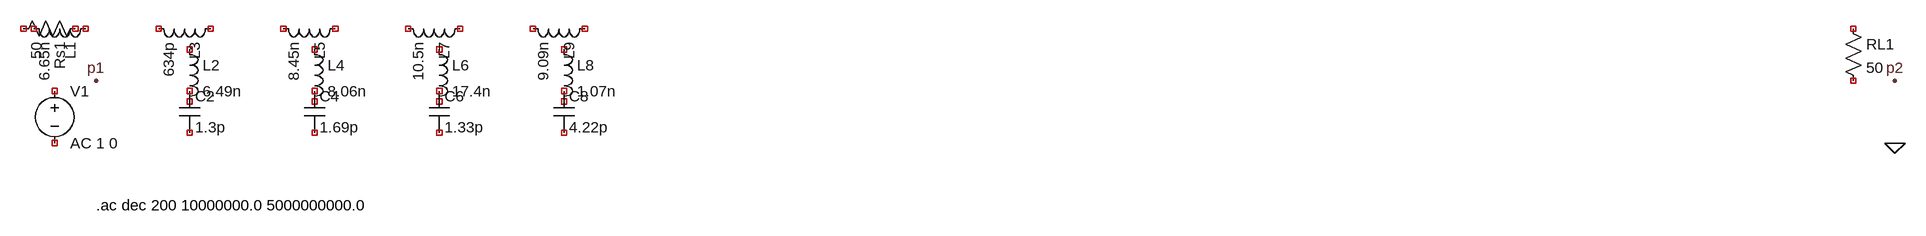
[diagram p0: schematic final.asc]
final.asc, the LTspice schematic file:
Version 4
SHEET 1 1280 720
SYMBOL voltage 32 144 R0
SYMATTR InstName V1
SYMATTR Value AC 1 0
SYMBOL res 80 48 R90
SYMATTR InstName Rs1
SYMATTR Value 50
SYMBOL ind 96 48 R90
SYMATTR InstName L1
SYMATTR Value 6.65n
SYMBOL ind 224 80 R0
SYMATTR InstName L2
SYMATTR Value 6.49n
SYMBOL cap 224 160 R0
SYMATTR InstName C2
SYMATTR Value 1.3p
SYMBOL ind 288 48 R90
SYMATTR InstName L3
SYMATTR Value 634p
SYMBOL ind 416 80 R0
SYMATTR InstName L4
SYMATTR Value 8.06n
SYMBOL cap 416 160 R0
SYMATTR InstName C4
SYMATTR Value 1.69p
SYMBOL ind 480 48 R90
SYMATTR InstName L5
SYMATTR Value 8.45n
SYMBOL ind 608 80 R0
SYMATTR InstName L6
SYMATTR Value 17.4n
SYMBOL cap 608 160 R0
SYMATTR InstName C6
SYMATTR Value 1.33p
SYMBOL ind 672 48 R90
SYMATTR InstName L7
SYMATTR Value 10.5n
SYMBOL ind 800 80 R0
SYMATTR InstName L8
SYMATTR Value 1.07n
SYMBOL cap 800 160 R0
SYMATTR InstName C8
SYMATTR Value 4.22p
SYMBOL ind 864 48 R90
SYMATTR InstName L9
SYMATTR Value 9.09n
SYMBOL res 2784 48 R0
SYMATTR InstName RL1
SYMATTR Value 50
TEXT 96 336 Left 2 !.ac dec 200 10000000.0 5000000000.0
FLAG 96 144 p1
FLAG 2864 144 p2
FLAG 2864 240 0

The netlist it stands for:
* final.asc
V1 NC_01 NC_02 AC 1 0
Rs1 NC_03 NC_04 50
L1 NC_05 NC_06 6.65n
L2 NC_07 NC_08 6.49n
C2 NC_09 NC_10 1.3p
L3 NC_11 NC_12 634p
L4 NC_13 NC_14 8.06n
C4 NC_15 NC_16 1.69p
L5 NC_17 NC_18 8.45n
L6 NC_19 NC_20 17.4n
C6 NC_21 NC_22 1.33p
L7 NC_23 NC_24 10.5n
L8 NC_25 NC_26 1.07n
C8 NC_27 NC_28 4.22p
L9 NC_29 NC_30 9.09n
RL1 NC_31 NC_32 50
.ac dec 200 10000000.0 5000000000.0
.backanno
.end